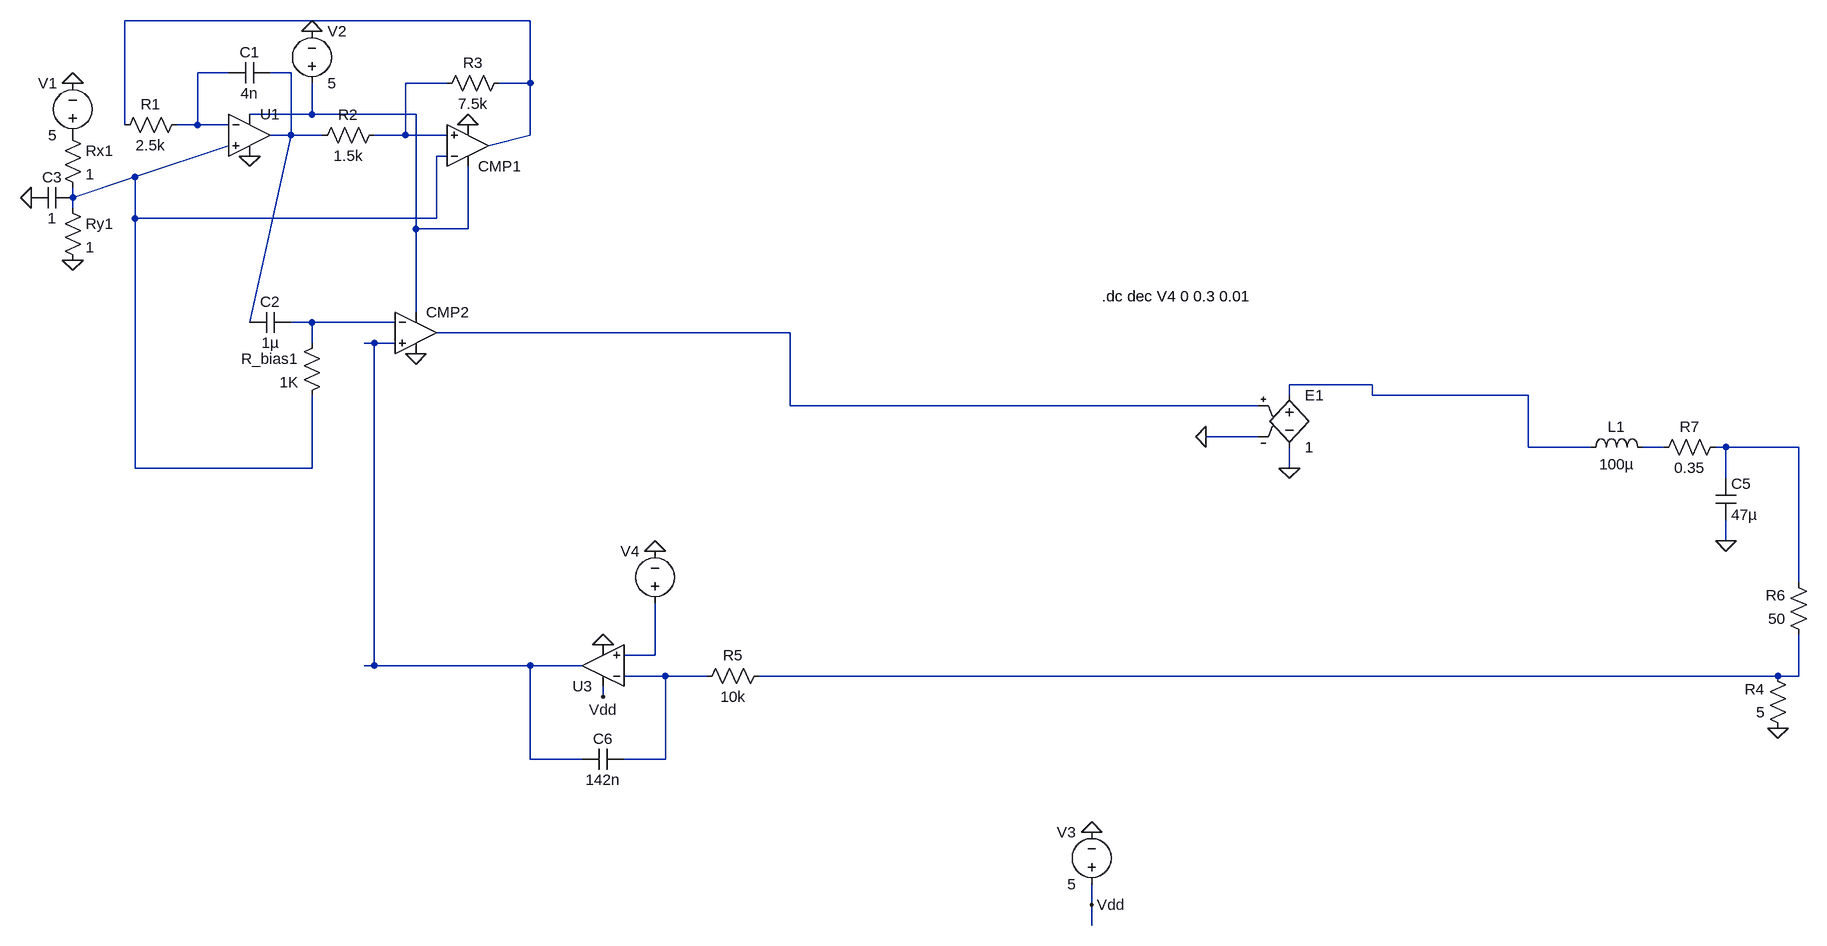
[diagram p0: schematic Module_3.asc]
Module_3.asc, the LTspice schematic file:
Version 4
SHEET 1 1484 1464
WIRE -640 -128 -1264 -128
WIRE -1104 -48 -1152 -48
WIRE -1008 -48 -1040 -48
WIRE -768 -32 -832 -32
WIRE -640 -32 -640 -128
WIRE -640 -32 -688 -32
WIRE -976 16 -976 -32
WIRE -976 16 -1072 16
WIRE -816 16 -976 16
WIRE -1264 32 -1264 -128
WIRE -1152 32 -1152 -48
WIRE -1152 32 -1184 32
WIRE -1104 32 -1152 32
WIRE -1008 48 -1008 -48
WIRE -1008 48 -1040 48
WIRE -960 48 -1008 48
WIRE -832 48 -832 -32
WIRE -832 48 -880 48
WIRE -768 48 -832 48
WIRE -640 48 -640 -32
WIRE -704 64 -640 48
WIRE -768 80 -784 80
WIRE -1248 112 -1104 64
WIRE -1344 144 -1248 112
WIRE -1344 144 -1344 128
WIRE -1344 160 -1344 144
WIRE -1248 176 -1248 112
WIRE -784 176 -784 80
WIRE -784 176 -1248 176
WIRE -816 192 -816 16
WIRE -736 192 -736 96
WIRE -736 192 -816 192
WIRE -816 320 -816 192
WIRE -1072 336 -1008 48
WIRE -976 336 -1008 336
WIRE -848 336 -976 336
WIRE -240 352 -784 352
WIRE -976 368 -976 336
WIRE -880 368 -896 368
WIRE -848 368 -880 368
WIRE 656 432 528 432
WIRE 528 448 528 432
WIRE 656 448 656 432
WIRE 896 448 656 448
WIRE -240 464 -240 352
WIRE 480 464 -240 464
WIRE 480 512 400 512
WIRE 896 528 896 448
WIRE 992 528 896 528
WIRE 1104 528 1072 528
WIRE 1200 528 1184 528
WIRE 1312 528 1200 528
WIRE -1248 560 -1248 176
WIRE -976 560 -976 448
WIRE -976 560 -1248 560
WIRE 528 560 528 528
WIRE 1200 576 1200 528
WIRE 1200 672 1200 640
WIRE 1312 736 1312 528
WIRE -448 848 -448 768
WIRE -448 848 -496 848
WIRE -880 864 -880 368
WIRE -880 864 -896 864
WIRE -640 864 -880 864
WIRE -560 864 -640 864
WIRE -432 880 -496 880
WIRE -368 880 -432 880
WIRE 1280 880 -288 880
WIRE 1312 880 1312 816
WIRE 1312 880 1280 880
WIRE -528 912 -528 896
WIRE -640 1008 -640 864
WIRE -560 1008 -640 1008
WIRE -432 1008 -432 880
WIRE -432 1008 -496 1008
WIRE 224 1232 224 1200
WIRE 224 1264 224 1232
FLAG -1344 -32 0
FLAG -1344 240 0
FLAG -976 -112 0
FLAG -1072 80 0
FLAG -816 384 0
FLAG -736 32 0
FLAG 1200 672 0
FLAG -528 912 Vdd
FLAG 1280 960 0
FLAG -528 832 0
FLAG 400 512 0
FLAG 528 560 0
FLAG 224 1120 0
FLAG 224 1232 Vdd
FLAG -1408 144 0
FLAG -448 688 0
SYMBOL voltage -1344 64 R180
WINDOW 0 24 96 Left 2
WINDOW 3 24 16 Left 2
SYMATTR InstName V1
SYMATTR Value 5
SYMBOL res -1360 32 R0
SYMATTR InstName Rx1
SYMATTR Value 1
SYMBOL res -1360 144 R0
SYMATTR InstName Ry1
SYMATTR Value 1
SYMBOL res -1168 16 R90
WINDOW 0 0 56 VBottom 2
WINDOW 3 32 56 VTop 2
SYMATTR InstName R1
SYMATTR Value 2.5k
SYMBOL res -864 32 R90
WINDOW 0 0 56 VBottom 2
WINDOW 3 32 56 VTop 2
SYMATTR InstName R2
SYMATTR Value 1.5k
SYMBOL res -672 -48 R90
WINDOW 0 0 56 VBottom 2
WINDOW 3 32 56 VTop 2
SYMATTR InstName R3
SYMATTR Value 7.5k
SYMBOL cap -1104 -32 R270
WINDOW 0 32 32 VTop 2
WINDOW 3 0 32 VBottom 2
SYMATTR InstName C1
SYMATTR Value 4n
SYMBOL cap -1008 320 R90
WINDOW 0 0 32 VBottom 2
WINDOW 3 32 32 VTop 2
SYMATTR InstName C2
SYMATTR Value 1µ
SYMBOL voltage -976 -16 M180
WINDOW 0 24 96 Left 2
WINDOW 3 24 16 Left 2
SYMATTR InstName V2
SYMATTR Value 5
SYMBOL res -960 352 M0
SYMATTR InstName R_bias1
SYMATTR Value 1K
SYMBOL UniversalOpamp2 -736 64 M180
SYMATTR InstName CMP1
SYMBOL UniversalOpamp2 -816 352 R0
SYMATTR InstName CMP2
SYMBOL UniversalOpamp2 -1072 48 R0
SYMATTR InstName U1
SYMBOL cap 1184 576 R0
SYMATTR InstName C5
SYMATTR Value 47µ
SYMBOL ind 976 544 R270
WINDOW 0 32 56 VTop 2
WINDOW 3 5 56 VBottom 2
SYMATTR InstName L1
SYMATTR Value 100µ
SYMBOL UniversalOpamp2 -528 864 R180
SYMATTR InstName U3
SYMBOL res -272 864 R90
WINDOW 0 0 56 VBottom 2
WINDOW 3 32 56 VTop 2
SYMATTR InstName R5
SYMATTR Value 10k
SYMBOL cap -496 992 R90
WINDOW 0 0 32 VBottom 2
WINDOW 3 32 32 VTop 2
SYMATTR InstName C6
SYMATTR Value 142n
SYMBOL res 1296 976 R180
WINDOW 0 36 76 Left 2
WINDOW 3 36 40 Left 2
SYMATTR InstName R4
SYMATTR Value 5
SYMBOL res 1328 832 R180
WINDOW 0 36 76 Left 2
WINDOW 3 36 40 Left 2
SYMATTR InstName R6
SYMATTR Value 50
SYMBOL e 528 432 R0
SYMATTR InstName E1
SYMATTR Value 1
SYMBOL res 1088 544 R270
WINDOW 0 32 56 VTop 2
WINDOW 3 0 56 VBottom 2
SYMATTR InstName R7
SYMATTR Value 0.35
SYMBOL voltage 224 1216 R180
WINDOW 0 24 96 Left 2
WINDOW 3 24 16 Left 2
SYMATTR InstName V3
SYMATTR Value 5
SYMBOL cap -1344 128 R90
WINDOW 0 0 32 VBottom 2
WINDOW 3 32 32 VTop 2
SYMATTR InstName C3
SYMATTR Value 1
SYMBOL voltage -448 784 R180
WINDOW 0 24 96 Left 2
WINDOW 3 24 16 Left 2
SYMATTR InstName V4
SYMATTR Value ""
TEXT 240 296 Left 2 !.dc dec V4 0 0.3 0.01

The netlist it stands for:
* Module_3.asc
V1 P001 0 5
Rx1 P001 N006 1
Ry1 N006 0 1
R1 N002 N001 2.5k
R2 N004 N003 1.5k
R3 N001 N004 7.5k
C1 N002 N003 4n
C2 N007 N003 1µ
V2 N005 0 5
R_bias1 N007 N006 1K
XCMP1 N004 N006 N005 0 N001 level.2 Avol=1Meg GBW=10Meg Slew=10Meg ilimit=25m rail=0 Vos=0 phimargin=45 en=0 enk=0 in=0 ink=0 Rin=500Meg  ; pins IN+ IN- V+ V- OUT
XCMP2 N009 N007 N005 0 N008 level.2 Avol=1Meg GBW=10Meg Slew=10Meg ilimit=25m rail=0 Vos=0 phimargin=45 en=0 enk=0 in=0 ink=0 Rin=500Meg  ; pins IN+ IN- V+ V- OUT
XU1 N006 N002 N005 0 N003 level.2 Avol=1Meg GBW=10Meg Slew=10Meg ilimit=25m rail=0 Vos=0 phimargin=45 en=0 enk=0 in=0 ink=0 Rin=500Meg  ; pins IN+ IN- V+ V- OUT
C5 N012 0 47µ
L1 N010 N011 100µ
XU3 N013 N014 Vdd 0 N009 level.2 Avol=1Meg GBW=10Meg Slew=10Meg ilimit=25m rail=0 Vos=0 phimargin=45 en=0 enk=0 in=0 ink=0 Rin=500Meg  ; pins IN+ IN- V+ V- OUT
R5 N015 N014 10k
C6 N014 N009 142n
R4 0 N015 5
R6 N015 N012 50
E1 N010 0 N008 0 1
R7 N011 N012 0.35
V3 Vdd 0 5
C3 N006 0 1
V4 N013 0
.dc dec V4 0 0.3 0.01
.lib UniversalOpamps2.sub
.backanno
.end